# Altium schematic sheet main.SchDoc
size A4
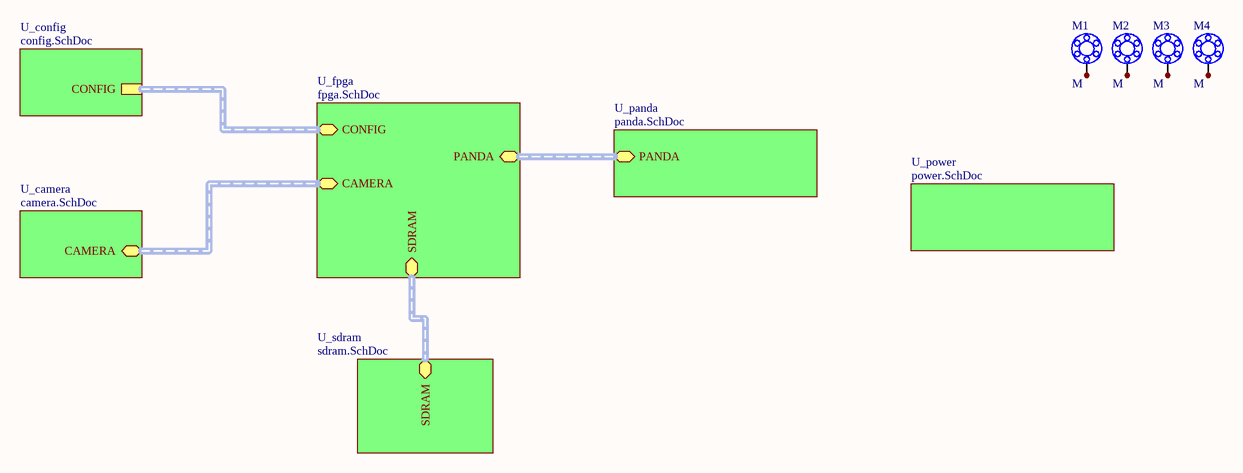
[diagram p0: main.SchDoc]

## Parts
M1  M  [MOUNTING]  (no BOM)
M2  M  [MOUNTING]  (no BOM)
M3  M  [MOUNTING]  (no BOM)
M4  M  [MOUNTING]  (no BOM)

## Sub-sheets
U_camera = camera.SchDoc: CAMERA (harness CAMERA)
U_config = config.SchDoc: CONFIG (harness CONFIG)
U_fpga = fpga.SchDoc: CONFIG (harness CONFIG), CAMERA (harness CAMERA), SDRAM (harness SDRAM), PANDA (harness PANDA)
U_panda = panda.SchDoc: PANDA (harness PANDA)
U_power = power.SchDoc: no entries
U_sdram = sdram.SchDoc: SDRAM (harness SDRAM)

## Nets
NetM1_1: M1.1 M1.2 M1.3 M1.4 M1.5 M1.6 M1.7
NetM2_1: M2.1 M2.2 M2.3 M2.4 M2.5 M2.6 M2.7
NetM3_1: M3.1 M3.2 M3.3 M3.4 M3.5 M3.6 M3.7
NetM4_1: M4.1 M4.2 M4.3 M4.4 M4.5 M4.6 M4.7

## Buses and harness runs
harness sheet U_camera/CAMERA = sheet U_fpga/CAMERA
harness sheet U_config/CONFIG = sheet U_fpga/CONFIG
harness sheet U_fpga/PANDA = sheet U_panda/PANDA
harness sheet U_fpga/SDRAM = sheet U_sdram/SDRAM

## Library data of the parts
M1-M4 = MOUNTING: MOUNTING HOLE - NON INSTALLABLE